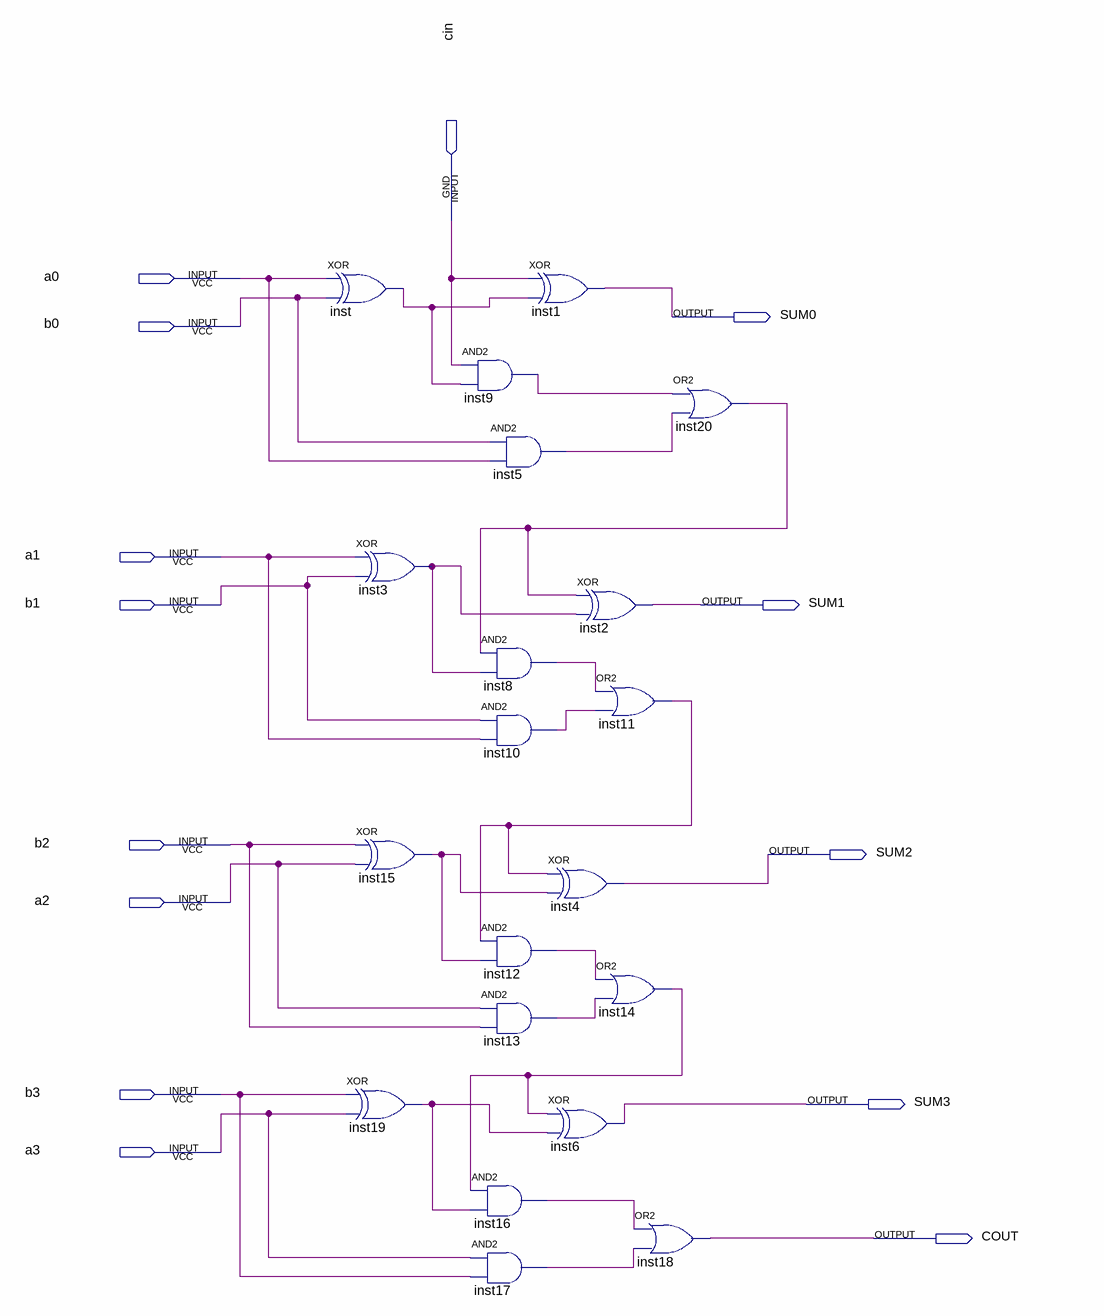
[diagram p0: schematic sheet]
// Quartus schematic Lab2.bdf as structural Verilog: 20 symbols, 14 pins
module Lab2 (
  input  cin,
  input  a0,
  input  b0,
  input  a1,
  input  b1,
  input  b2,
  input  a2,
  input  b3,
  input  a3,
  output SUM0,
  output SUM1,
  output SUM2,
  output SUM3,
  output COUT
);

  wire inst3_out, inst5_out, inst8_out, inst9_out, inst10_out, inst11_out, inst12_out, inst13_out,
       inst14_out, inst15_out, inst16_out, inst17_out, inst19_out, inst20_out, inst_out;

  xor inst (inst_out, a0, b0);
  xor inst19 (inst19_out, b3, a3);
  xor inst3 (inst3_out, a1, b1);
  xor inst15 (inst15_out, b2, a2);
  and inst9 (inst9_out, cin, inst_out);
  and inst5 (inst5_out, b0, a0);
  and inst8 (inst8_out, inst20_out, inst3_out);
  and inst10 (inst10_out, b1, a1);
  and inst12 (inst12_out, inst11_out, inst15_out);
  and inst13 (inst13_out, a2, b2);
  and inst16 (inst16_out, inst14_out, inst19_out);
  and inst17 (inst17_out, a3, b3);
  xor inst1 (SUM0, cin, inst_out);
  xor inst2 (SUM1, inst20_out, inst3_out);
  xor inst4 (SUM2, inst11_out, inst15_out);
  xor inst6 (SUM3, inst14_out, inst19_out);
  or inst11 (inst11_out, inst8_out, inst10_out);
  or inst14 (inst14_out, inst12_out, inst13_out);
  or inst18 (COUT, inst16_out, inst17_out);
  or inst20 (inst20_out, inst9_out, inst5_out);
endmodule
